# EasyEDA Pro project HIP4082电机驱动.eprj

# Schematic 电机驱动原理图
Create Date: 2023-09-19; Page Name: P1; Project Name: HIP4082电机驱动; Schematic Name: 电机驱动原理图; Update Date: 2023-10-26; Company: 嘉立创EDA; Page Size: A4; Version: V1.0
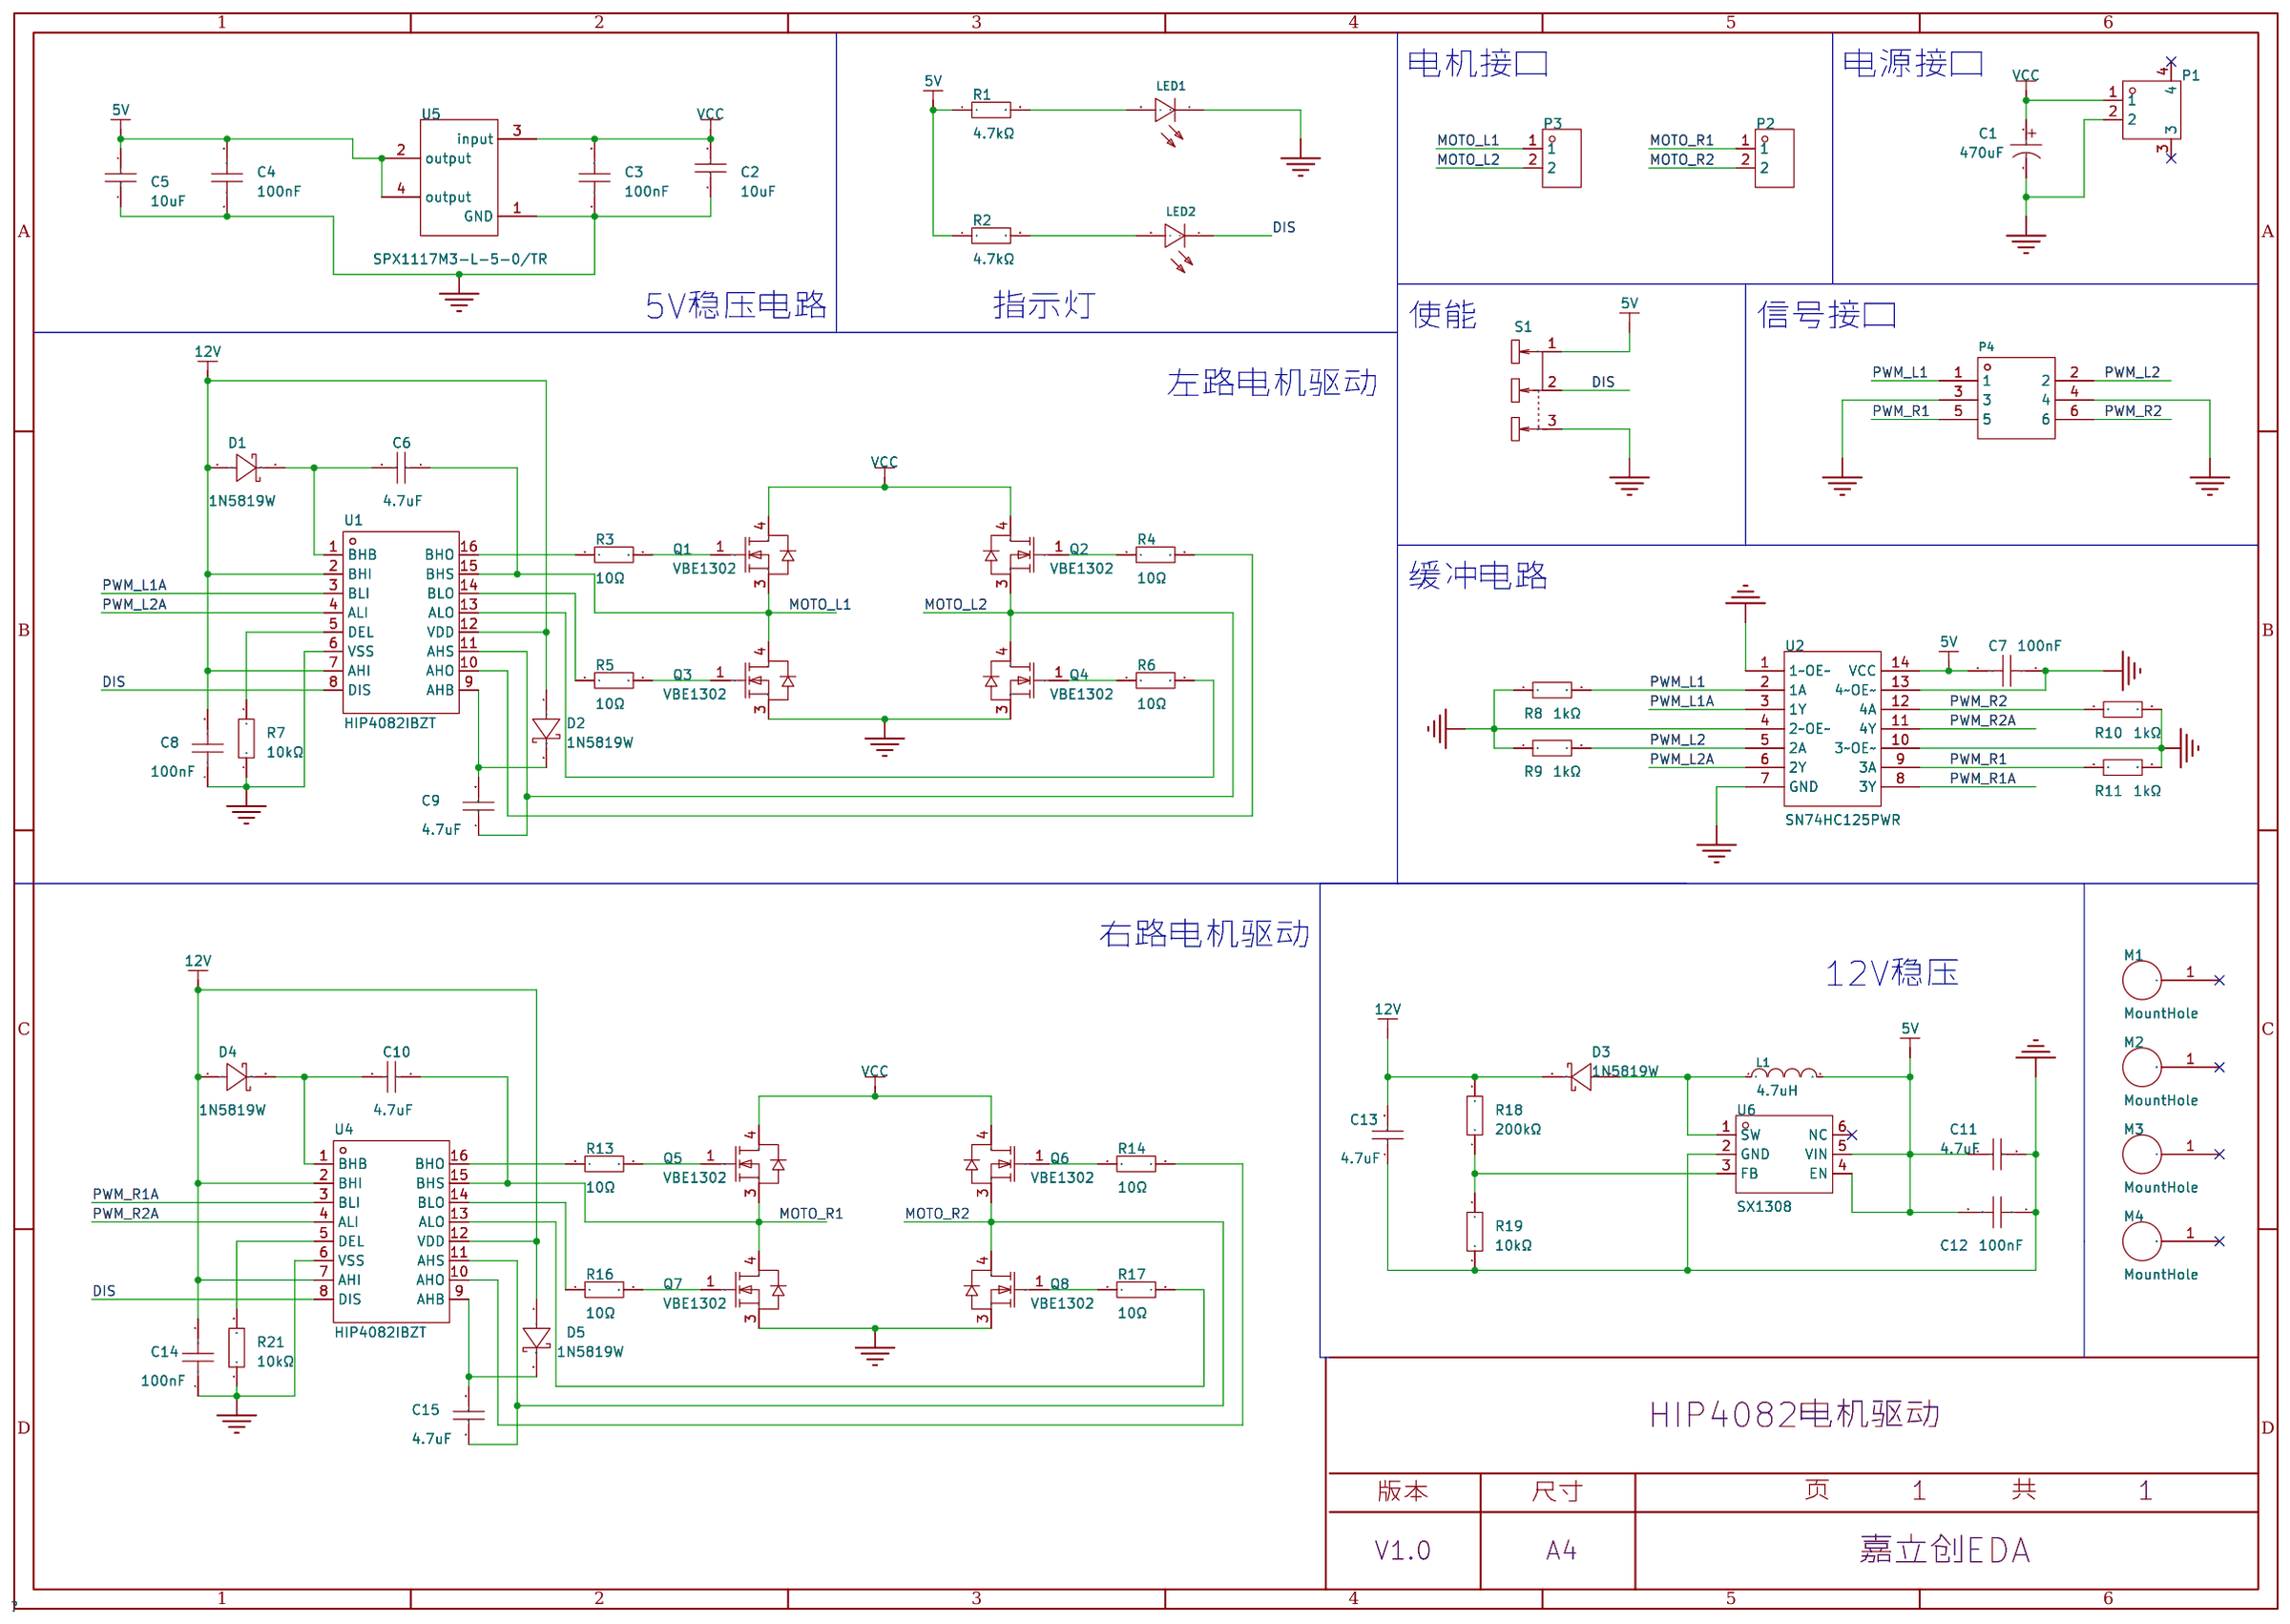
[diagram p0: schematic sheet]

## Parts
C1  470uF  [CAP-TH_BD8.0-P3.50-D0.6-FD]
C2  10uF  [C0805]
C3  100nF  [C0603]
C4  100nF  [C0603]
C5  10uF  [C0805]
C6  4.7uF  [C0603]
C7  100nF  [C0603]
C8  100nF  [C0603]
C9  4.7uF  [C0603]
C10  4.7uF  [C0603]
C11  4.7uF  [C0603]
C12  100nF  [C0603]
C13  4.7uF  [C0603]
C14  100nF  [C0603]
C15  4.7uF  [C0603]
D1  1N5819W  [SOD-123_L2.7-W1.6-LS3.7-R-RD]
D2  1N5819W  [SOD-123_L2.7-W1.6-LS3.7-R-RD]
D3  1N5819W  [SOD-123_L2.7-W1.6-LS3.7-R-RD]
D4  1N5819W  [SOD-123_L2.7-W1.6-LS3.7-R-RD]
D5  1N5819W  [SOD-123_L2.7-W1.6-LS3.7-R-RD]
L1  4.7uH  [IND-SMD_L5.4-W5.2_FXL0530]
LED1  NCD0603R1  [LED0603-RD_RED]
LED2  NCD0603B1  [LED0603-RD]
M1  MountHole  [M3-MountSlot]
M2  MountHole  [M3-MountSlot]
M3  MountHole  [M3-MountSlot]
M4  MountHole  [M3-MountSlot]
P1  XT30PW-M  [CONN-TH_XT30PW-M]
P2  XT30U-M  [CONN-TH_XT30U-M]
P3  XT30U-M  [CONN-TH_XT30U-M]
P4  75869-131LF  [CONN-TH_6P-P2.54_75869-131LF]
Q1  VBE1302  [TO-252-2_L6.6-W6.1-P4.58-LS9.9-TL-1]
Q2  VBE1302  [TO-252-2_L6.6-W6.1-P4.58-LS9.9-TL-1]
Q3  VBE1302  [TO-252-2_L6.6-W6.1-P4.58-LS9.9-TL-1]
Q4  VBE1302  [TO-252-2_L6.6-W6.1-P4.58-LS9.9-TL-1]
Q5  VBE1302  [TO-252-2_L6.6-W6.1-P4.58-LS9.9-TL-1]
Q6  VBE1302  [TO-252-2_L6.6-W6.1-P4.58-LS9.9-TL-1]
Q7  VBE1302  [TO-252-2_L6.6-W6.1-P4.58-LS9.9-TL-1]
Q8  VBE1302  [TO-252-2_L6.6-W6.1-P4.58-LS9.9-TL-1]
R1  4.7kΩ  [R0603]
R2  4.7kΩ  [R0603]
R3  10Ω  [R0603]
R4  10Ω  [R0603]
R5  10Ω  [R0603]
R6  10Ω  [R0603]
R7  10kΩ  [R0603]
R8  1kΩ  [R0603]
R9  1kΩ  [R0603]
R10  1kΩ  [R0603]
R11  1kΩ  [R0603]
R13  10Ω  [R0603]
R14  10Ω  [R0603]
R16  10Ω  [R0603]
R17  10Ω  [R0603]
R18  200kΩ  [R0603]
R19  10kΩ  [R0603]
R21  10kΩ  [R0603]
S1  SS-12D10L3  [SW-TH_SS-12D10L3]
U1  HIP4082IBZT  [SOIC-16_L9.9-W3.9-P1.27-LS6.0-BL]
U2  SN74HC125PWR  [TSSOP-14]
U4  HIP4082IBZT  [SOIC-16_L9.9-W3.9-P1.27-LS6.0-BL]
U5  SPX1117M3-L-5-0/TR  [SOT-223-4_L6.5-W3.5-P2.30-LS7.0-BR]
U6  SX1308  [SOT-23-6_L2.9-W1.6-P0.95-LS2.8-BL]

## Library data of the parts
C1 = KM477M025F12RR0VH2FP0: 容值:470uF;精度:±20%;额定电压:25V;; LCSC Part Name: 470uF ±20% 25V; Supplier Part: C43839; Manufacturer: CX(承兴); Supplier Footprint: 插件,D8xL12mm; JLCPCB Part Class: Extended Part; Datasheet: https://atta.szlcsc.com/upload/public/pdf/source/20211027/06D6BA3719C264B639DC286D935D03EA.pdf; Supplier: LCSC; Tolerance: ±20%; Rated Voltage: 25V; φD: 8mm; L: 12mm; Lead Spacing: 3.5mm; Lifetime @ Temp: 2000hrs@105℃
C2 C5 = CL21A106KAYNNNE_C15850: 容值:10uF;精度:±10%;额定电压:25V;材质(温度系数):X5R;; LCSC Part Name: 10uF ±10% 25V; Supplier Part: C15850; Manufacturer: SAMSUNG(三星); Manufacturer Part: CL21A106KAYNNNE; Supplier Footprint: 0805; JLCPCB Part Class: Basic Part; Datasheet: https://atta.szlcsc.com/upload/public/pdf/source/20160103/1457707679302.pdf; Supplier: LCSC; Tolerance: ±10%; Voltage Rated: 25V; Temperature Coefficient: X5R
C3 C4 C7 C8 C12 C14 = CAP_0603: Supplier Footprint: 0603
C6 C9-C11 C13 C15 = CL10A475KO8NNNC: 容值:4.7uF;精度:±10%;额定电压:16V;材质(温度系数):X5R;; LCSC Part Name: 4.7uF ±10% 16V; Supplier Part: C19666; Manufacturer: SAMSUNG(三星); Supplier Footprint: 0603; JLCPCB Part Class: Basic Part; Datasheet: https://atta.szlcsc.com/upload/public/pdf/source/20160103/1457707703134.pdf; Supplier: LCSC; Tolerance: ±10%; Voltage Rated: 16V; Temperature Coefficient: X5R
D1-D5 = 1N5819W_C963381: 二极管配置:独立式;直流反向耐压(Vr):40V;平均整流电流(Io):350mA;正向压降(Vf):600mV@200mA;反向电流(Ir):5uA@30V;; LCSC Part Name: 40V 350mA 600mV@200mA; Supplier Part: C963381; Manufacturer: JSMSEMI(杰盛微); Supplier Footprint: SOD-123; JLCPCB Part Class: 扩展库; Datasheet: https://atta.szlcsc.com/upload/public/pdf/source/20211201/C266112E93E924DFE0C071C9A8E85281.pdf; Supplier: LCSC; Diode Configuration: 独立式; Reverse Voltage (Vr): 40V; Average Rectified Current (Io): 350mA; Forward Voltage (Vf@If): 600mV@200mA; Reverse Leakage Current (Ir): 5uA@30V
L1 = FXL0530-4R7-M: 电感值:4.7uH;精度:±20%;额定电流:4.5A;饱和电流(Isat):5A;; LCSC Part Name: 4.7uH ±20% 4.5A 50mΩ; Supplier Part: C177246; Manufacturer: cjiang(长江微电); Supplier Footprint: SMD,5.4x5.2x2.8mm; JLCPCB Part Class: Extended Part; Supplier: LCSC; Tolerance: ±20%; Rated Current: 4.5A; Saturation Current (Isat): 5A; DC Resistance (DCR): 50mΩ
LED1 = NCD0603R1_C84263: 发光颜色:红灯;; LCSC Part Name: 红灯 0603红灯   正贴; Supplier Part: C84263; Manufacturer: 国星光电; Supplier Footprint: 0603; JLCPCB Part Class: 扩展库; Datasheet: https://atta.szlcsc.com/upload/public/pdf/source/20200820/C84263_DABC6A75E58F576973B407FDBA283D60.pdf; Supplier: LCSC; Emitted Color: 红灯
LED2 = NCD0603B1: 发光颜色:蓝灯;; LCSC Part Name: 蓝灯; Supplier Part: C84266; Manufacturer: 国星光电; Supplier Footprint: 0603; JLCPCB Part Class: 扩展库; Datasheet: https://atta.szlcsc.com/upload/public/pdf/source/20200820/C84266_6A3CDBEFA72C6CAD68EDA53474ADAE6C.pdf; Supplier: LCSC; Emitted Color: 蓝灯
M1-M4 = MountHole
P1 = XT30PW-M: Socket,DCsupply,XT30,male,PIN:2; LCSC Part Name: AMASS(艾迈斯)航模插头 卧式弯脚 XT30PW-M公头; Supplier Part: C431092; Manufacturer: AMASS(艾迈斯); JLCPCB Part Class: Extended Part; Datasheet: https://atta.szlcsc.com/upload/public/pdf/source/20220222/6A9F22F7850E25B33E1BE430ADF8560B.pdf; Supplier: LCSC
P2 P3 = XT30U-M: 模型插头轻量版锂电池插头; LCSC Part Name: AMASS(艾迈斯)轻量版锂电池插头公头 XT30U-M; Supplier Part: C99101; Manufacturer: AMASS(艾迈斯); JLCPCB Part Class: Extended Part; Datasheet: https://atta.szlcsc.com/upload/public/pdf/source/20170606/1496716542582.pdf; Supplier: LCSC
P4 = 75869-131LF: 参考系列:-;间距:2.54mm;插针结构:2x3P;排数:2;每排PIN数:3;行距:2.54mm;安装方式:-;触头材质:磷青铜;; LCSC Part Name: 2.54mm 2x3P; Supplier Part: C168680; Manufacturer: Amphenol; Supplier Footprint: 插件,P=2.54mm; JLCPCB Part Class: 扩展库; Supplier: LCSC; Pitch: 2.54mm; Pins Structure: 2x3P; Number of Rows: 2; Number of PINs Per Row: 3; Row Spacing: 2.54mm; Contact Material: 磷青铜
Q1-Q8 = VBE1302: 类型:N沟道;漏源电压(Vdss):30V;连续漏极电流(Id):120A;功率(Pd):250W;导通电阻(RDS(on)@Vgs,Id):2.3mΩ@10V,38.8A;阈值电压(Vgs(th)@Id):2.5V@250uA;; LCSC Part Name: N沟道 30V 120A; Supplier Part: C480950; Manufacturer: VBsemi(微碧); Supplier Footprint: TO-252; JLCPCB Part Class: Extended Part; Datasheet: https://atta.szlcsc.com/upload/public/pdf/source/20200107/C480950_B2D90700319A601701C79A4F7CBE2FAC.pdf; Supplier: LCSC; Type: N沟道; Drain Source Voltage (Vdss): 30V; Continuous Drain Current (Id): 120A; Power Dissipation (Pd): 250W; Drain Source On Resistance (RDS(on)@Vgs,Id): 2.3mΩ@10V,38.8A; Gate Threshold Voltage (Vgs(th)@Id): 2.5V@250uA
R1 R2 = 0603WAF4701T5E: 电阻类型:厚膜电阻;阻值:4.7kΩ;精度:±1%;功率:100mW;; LCSC Part Name: 4.7kΩ ±1% 100mW; Supplier Part: C23162; Manufacturer: UNI-ROYAL(厚声); Supplier Footprint: 0603; JLCPCB Part Class: 基础库; Datasheet: https://atta.szlcsc.com/upload/public/pdf/source/20200306/C422600_1E6D84923E4A46A82E41ADD87F860B5C.pdf; Supplier: LCSC; Type: 厚膜电阻; Tolerance: ±1%; Power(Watts): 100mW; Temperature Coefficient: ±100ppm/℃; Overload Voltage (Max): 75V; Operating Temperature Range: -55℃~+155℃
R3-R6 R13 R14 R16 R17 = 0603WAF100JT5E: 电阻类型:厚膜电阻;阻值:10Ω;精度:±1%;功率:100mW;; LCSC Part Name: 10Ω ±1% 100mW; Supplier Part: C22859; Manufacturer: UNI-ROYAL(厚声); Supplier Footprint: 0603; JLCPCB Part Class: 基础库; Datasheet: https://atta.szlcsc.com/upload/public/pdf/source/20200306/C422600_1E6D84923E4A46A82E41ADD87F860B5C.pdf; Supplier: LCSC; Type: 厚膜电阻; Tolerance: ±1%; Power(Watts): 100mW; Temperature Coefficient: ±400ppm/℃; Overload Voltage (Max): 75V; Operating Temperature Range: -55℃~+155℃
R7 R19 R21 = 0603WAF1002T5E: 电阻类型:厚膜电阻;阻值:10kΩ;精度:±1%;功率:100mW;; LCSC Part Name: 厚膜电阻 10kΩ ±1% 100mW; Supplier Part: C25804; Manufacturer: UNI-ROYAL(厚声); Supplier Footprint: 0603; JLCPCB Part Class: Basic Part; Datasheet: https://atta.szlcsc.com/upload/public/pdf/source/20200306/C422600_1E6D84923E4A46A82E41ADD87F860B5C.pdf; Supplier: LCSC; Type: 厚膜电阻; Tolerance: ±1%; Power(Watts): 100mW; Temperature Coefficient: ±100ppm/℃; Overload Voltage (Max): 75V; Operating Temperature Range: -55℃~+155℃
R8-R11 = 0603WAF1001T5E: 电阻类型:厚膜电阻;阻值:1kΩ;精度:±1%;功率:100mW;; LCSC Part Name: 1kΩ ±1% 100mW; Supplier Part: C21190; Manufacturer: UNI-ROYAL(厚声); Supplier Footprint: 0603; JLCPCB Part Class: Basic Part; Datasheet: https://atta.szlcsc.com/upload/public/pdf/source/20200306/C422600_1E6D84923E4A46A82E41ADD87F860B5C.pdf; Supplier: LCSC; Type: 厚膜电阻; Tolerance: ±1%; Power(Watts): 100mW; Temperature Coefficient: ±100ppm/℃; Overload Voltage (Max): 75V; Operating Temperature Range: -55℃~+155℃
R18 = 0603WAF2003T5E: 电阻类型:厚膜电阻;阻值:200kΩ;精度:±1%;功率:100mW;; LCSC Part Name: 200kΩ ±1% 100mW; Supplier Part: C25811; Manufacturer: UNI-ROYAL(厚声); Supplier Footprint: 0603; JLCPCB Part Class: Basic Part; Datasheet: https://atta.szlcsc.com/upload/public/pdf/source/20200306/C422600_1E6D84923E4A46A82E41ADD87F860B5C.pdf; Supplier: LCSC; Type: 厚膜电阻; Tolerance: ±1%; Power(Watts): 100mW; Temperature Coefficient: ±100ppm/℃; Overload Voltage (Max): 75V; Operating Temperature Range: -55℃~+155℃
S1 = SS-12D10L3: 额定电流(DC):3A;额定电压(DC):125V;额定电流(AC):3A;额定电压(AC):125V;电路结构:单刀双掷;安装方式:直插;机械寿命:1万次;开关颜色:黑色;; LCSC Part Name: 柄长3mm 直插双档 滑动开关 大电流; Supplier Part: C319013; Manufacturer: XKB Connectivity(中国星坤); Supplier Footprint: 插件; JLCPCB Part Class: 扩展库; Datasheet: https://atta.szlcsc.com/upload/public/pdf/source/20211009/D6412F37AABE6F9459A6EE7FA4DAEADB.pdf; Supplier: LCSC; Current Rating (DC): 3A; Voltage Rating (DC): 125V; Current Rating (AC): 3A; Voltage Rating (AC): 125V; Circuit: 单刀双掷; Mounting Style: 直插; Mechanical Life: 1万次; Actuator Color: 黑色; Actuator Style: 矩形柱状; Pin Style: PC引脚; Operating Temperature: -40℃~+85℃; Switch Length: 13mm; Switch Width: 6.8mm; Switch Height: 6.4mm
U1 U4 = HIP4082IBZT: 驱动配置:半桥；全桥;负载类型:MOSFET;电源电压:8.5V~15V;; LCSC Part Name: 半桥 全桥 MOSFET; Supplier Part: C50123; Manufacturer: RENESAS(瑞萨)/IDT; Supplier Footprint: SOIC-16; JLCPCB Part Class: 扩展库; Datasheet: https://atta.szlcsc.com/upload/public/pdf/source/20170105/1483610742408.pdf; Supplier: LCSC; Driven Configuration: 半桥；全桥; Load Type: MOSFET; Supply Voltage: 8.5V~15V; Operating Temperature: -55℃~+150℃@(Tj)
U2 = SN74HC125PWR
U5 = SPX1117M3-L-5-0/TR: 输出类型:固定;输出极性:正;最大输入电压:20V;输出电压:5V;输出电流:800mA;电源纹波抑制比(PSRR):75dB@(120Hz);; Supplier Part: C21946; Manufacturer: MaxLinear; Supplier Footprint: SOT-223-4; JLCPCB Part Class: 扩展库; Datasheet: https://atta.szlcsc.com/upload/public/pdf/source/20150912/1457707353858.pdf; Supplier: LCSC; Output Type: 固定; Output Polarity: 正; Number of Outputs: 1; Maximum Input Voltage: 20V; Output Voltage: 5V; Dropout Voltage: 1.3V@(800mA); Output Current: 800mA; Power Supply Rejection Ratio (PSRR): 75dB@(120Hz)
U6 = SX1308: 功能类型:升压型;同步整流:否;输出通道数:1;拓扑结构:升压式;输入电压:2V~24V;输出电压:28V;输出电流(最大值):-;开关频率:1.2MHz;; LCSC Part Name: 升压型 Vin=2V~24V Vout=28V; Supplier Part: C78162; Manufacturer: SX(硕芯科技); Supplier Footprint: SOT-23-6; JLCPCB Part Class: 扩展库; Datasheet: https://atta.szlcsc.com/upload/public/pdf/source/20160920/1474356679185.pdf; Supplier: LCSC; Function: 升压型; Synchronous Rectification: 否; Number of Outputs: 1; Topology: 升压式; Input Voltage: 2V~24V; Output Voltage: 28V; Switching Frequency: 1.2MHz

## Nets
5V: C4.2 C5.2 C7.2 C11.1 C12.2 L1.2 R1.1 R2.1 S1.1 U2.14(VCC) U5.2(output) U5.4(output) U6.4(EN) U6.5(VIN)
12V: C8.2 C13.2 C14.2 D1.1(A) D2.1(A) D3.2(C) D4.1(A) D5.1(A) R18.2 U1.2(BHI) U1.7(AHI) U1.12(VDD) U4.2(BHI) U4.7(AHI) U4.12(VDD)
GND: C1.2 C2.1 C3.1 C4.1 C5.1 C7.1 C8.1 C11.2 C12.1 C13.1 C14.1 LED1.1(K) P1.2 P4.3 P4.4 Q3.3(S) Q4.3(S) Q7.3(S) Q8.3(S) R7.1 R8.1 R9.1 R10.2 R11.2 R19.1 R21.1 S1.3 U1.6(VSS) U2.1(1~OE~) U2.4(2~OE~) U2.7(GND) U2.10(3~OE~) U2.13(4~OE~) U4.6(VSS) U5.1(GND) U6.2(GND)
VCC: C1.1 C2.2 C3.2 P1.1 Q1.4(D) Q2.4(D) Q5.4(D) Q6.4(D) U5.3(input)
DIS: LED2.1(-) S1.2 U1.8(DIS) U4.8(DIS)
MOTO_L1: C6.2 P3.1 Q1.3(S) Q3.4(D) U1.15(BHS)
MOTO_L2: C9.1 P3.2 Q2.3(S) Q4.4(D) U1.11(AHS)
MOTO_R1: C10.2 P2.1 Q5.3(S) Q7.4(D) U4.15(BHS)
MOTO_R2: C15.1 P2.2 Q6.3(S) Q8.4(D) U4.11(AHS)
PWM_L1: P4.1 R8.2 U2.2(1A)
PWM_L1A: U1.3(BLI) U2.3(1Y)
PWM_L2: P4.2 R9.2 U2.5(2A)
PWM_L2A: U1.4(ALI) U2.6(2Y)
PWM_R1: P4.5 R11.1 U2.9(3A)
PWM_R1A: U2.8(3Y) U4.3(BLI)
PWM_R2: P4.6 R10.1 U2.12(4A)
PWM_R2A: U2.11(4Y) U4.4(ALI)
$1N3040: D3.1(A) L1.1 U6.1(SW)
$1N3062: R18.1 R19.2 U6.3(FB)
$1N3258: C6.1 D1.2(C) U1.1(BHB)
$1N3267: R3.1 U1.16(BHO)
$1N3270: Q1.1(G) R3.2
$1N3283: Q2.1(G) R4.1
$1N3296: Q3.1(G) R5.2
$1N3336: R5.1 U1.14(BLO)
$1N3352: Q4.1(G) R6.1
$1N3355: R6.2 U1.13(ALO)
$1N3402: R4.2 U1.10(AHO)
$1N3493: C9.2 D2.2(C) U1.9(AHB)
$1N3539: R7.2 U1.5(DEL)
$1N4214: C10.1 D4.2(C) U4.1(BHB)
$1N4219: R13.1 U4.16(BHO)
$1N4221: Q5.1(G) R13.2
$1N4227: Q6.1(G) R14.1
$1N4229: Q7.1(G) R16.2
$1N4242: R16.1 U4.14(BLO)
$1N4257: Q8.1(G) R17.1
$1N4259: R17.2 U4.13(ALO)
$1N4265: R14.2 U4.10(AHO)
$1N4285: C15.2 D5.2(C) U4.9(AHB)
$1N4295: R21.2 U4.5(DEL)
Net-(LED1-2): LED1.2(A) R1.2
Net-(LED2-2): LED2.2(+) R2.2

Not connected (* = marked no-connect by the designer): M1 1*; M2 1*; M3 1*; M4 1*; P1 3* 4*; U6 6(NC)*

## Notes on the sheet
- 电机接口
- 电源接口
- 5V稳压电路
- 指示灯
- 使能
- 信号接口
- 左路电机驱动
- 缓冲电路
- 右路电机驱动
- 12V稳压

# Board PCB1
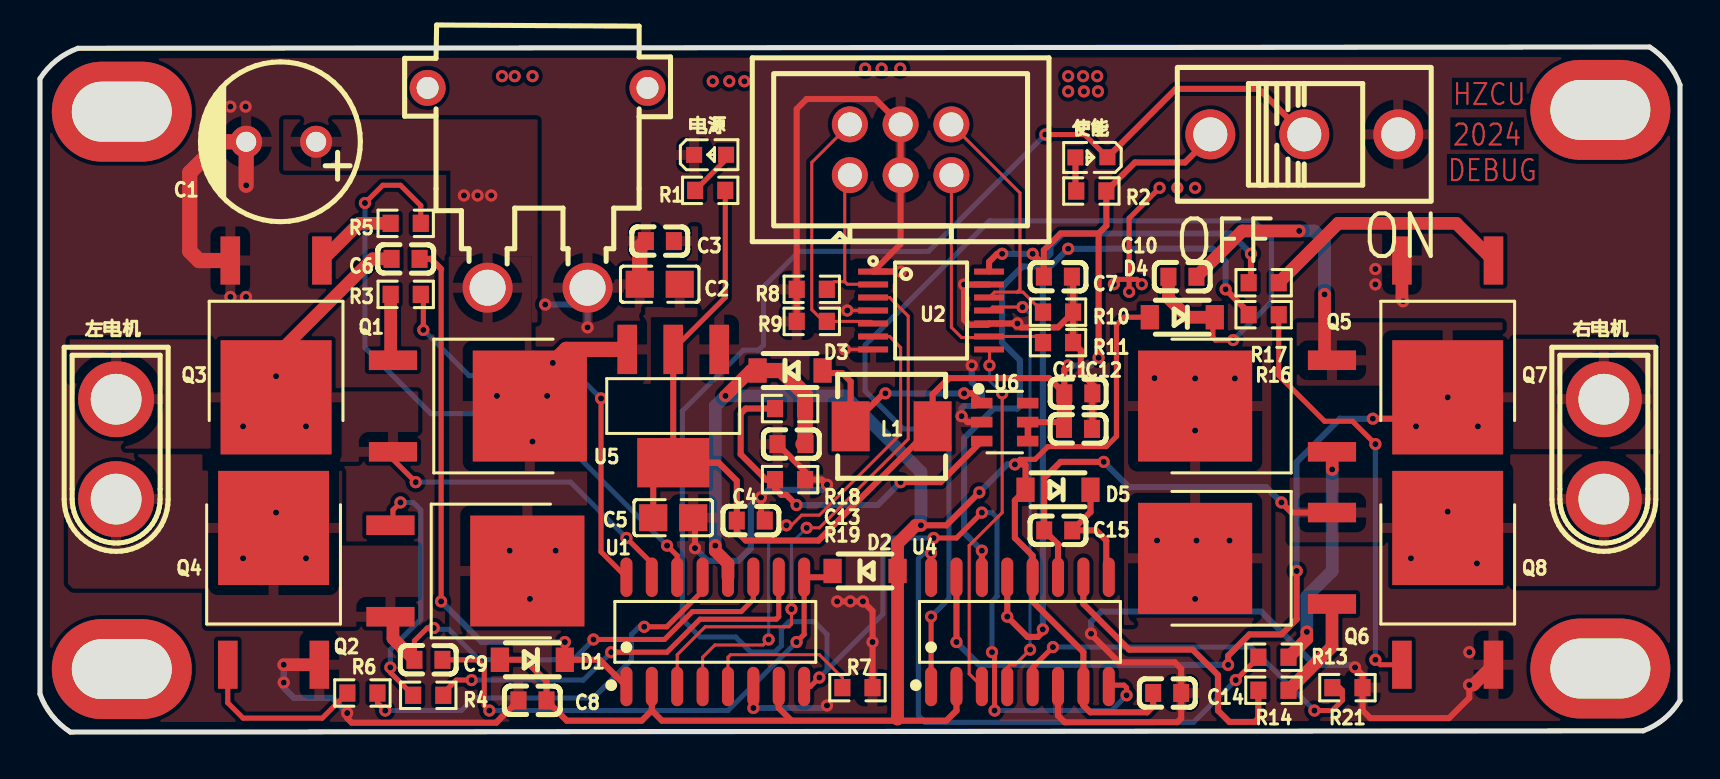
[diagram p1: board, top side]
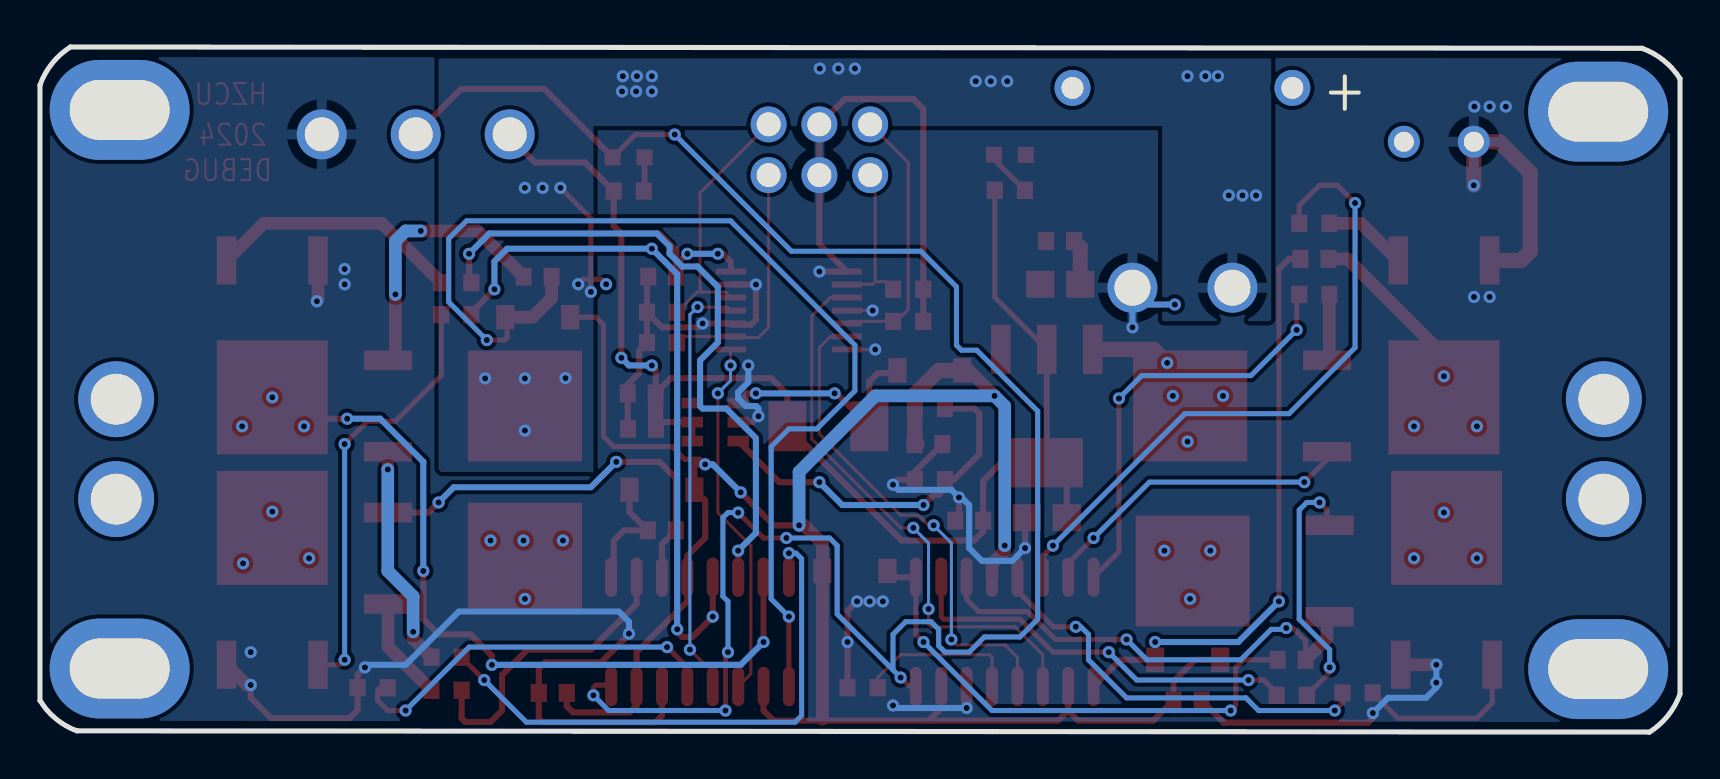
[diagram p2: board, bottom side, seen from below]

Outline 82.04 x 34.29 mm; copper layers: Top Layer, Bottom Layer. Coordinates in mm from the lower left corner of the outline.
Outline path: 0,32.7 arc(0.83,33.62) 1.91,34.23 80.52,34.29 arc(81.44,33.46) 82.04,32.38 82.04,1.59 arc(81.25,0.67) 80.2,0.06 1.52,0 arc(0.6,0.83) 0,1.91 0,32.7
Stack: Top Layer 0.035mm / Dielectric1 1.51mm FR4 er 4.5 / Bottom Layer 0.035mm

## Design rules (mm)
template: JLCPCB Capability(Two Layers Board)
spacing copperThickness1oz (default): track to track 0.102, other pairs 0.152 to 0.3
spacing copperThickness2oz: track to track 0.203, other pairs 0.152 to 0.3
track width copperThickness1oz (default): min 0.127, default 0.254, max 2.54
track width copperThickness2oz: min 0.203, default 0.254, max 2.54
differential pair differentialPair (default): width min 0.127, default 0.254, max 2.54; gap min 0.152, default 0.152
via viaSize (default): diameter min 0.5, default 0.61, max 10; hole min 0.3, default 0.305, max 6.3

## Placement (name value [footprint] x y rotation side)
C1  470uF  [CAP-TH_BD8.0-P3.50-D0.6-FD]  12.06 29.55 180 top
C2  10uF  [C0805]  31 22.42 0 top
C3  100nF  [C0603]  31.01 24.57 0 top
C4  100nF  [C0603]  35.56 10.59 180 top
C5  10uF  [C0805]  31.68 10.73 180 top
C6  4.7uF  [C0603]  18.29 23.69 180 top
C7  100nF  [C0603]  50.92 22.8 180 top
C8  100nF  [C0603]  24.64 1.59 0 top
C9  4.7uF  [C0603]  19.43 3.62 0 top
C10  4.7uF  [C0603]  57.15 22.79 0 top
C11  4.7uF  [C0603]  51.94 16.95 0 top
C12  100nF  [C0603]  51.93 15.18 180 top
C13  4.7uF  [C0603]  37.59 14.41 0 top
C14  100nF  [C0603]  56.39 1.96 180 top
C15  4.7uF  [C0603]  50.93 10.1 0 top
D1  1N5819W  [SOD-123_L2.7-W1.6-LS3.7-R-RD]  24.63 3.62 180 top
D2  1N5819W  [SOD-123_L2.7-W1.6-LS3.7-R-RD]  41.28 8.06 0 top
D3  1N5819W  [SOD-123_L2.7-W1.6-LS3.7-R-RD]  37.52 18.1 0 top
D4  1N5819W  [SOD-123_L2.7-W1.6-LS3.7-R-RD]  57.14 20.76 180 top
D5  1N5819W  [SOD-123_L2.7-W1.6-LS3.7-R-RD]  50.93 12.13 180 top
L1  4.7uH  [IND-SMD_L5.4-W5.2_FXL0530]  42.6 15.3 0 top
M1  MountHole  [M3-MountSlot]  -106.66 2.57 0 top
M2  MountHole  [M3-MountSlot]  -106.66 30.47 0 top
M3  MountHole  [M3-MountSlot]  -32.69 30.56 0 top
M4  MountHole  [M3-MountSlot]  -32.69 2.6 0 top
P1  XT30PW-M  [conn-th_xt30pw-m]  24.89 27.24 180 top
P4  75869-131LF  [CONN-TH_6P-P2.54_75869-131LF]  43.05 29.15 0 top
Q1  VBE1302  [TO-252-2_L6.6-W6.1-P4.58-LS9.9-TL-1]  21.08 16.32 0 top
Q2  VBE1302  [TO-252-2_L6.6-W6.1-P4.58-LS9.9-TL-1]  20.96 8.06 0 top
Q3  VBE1302  [TO-252-2_L6.6-W6.1-P4.58-LS9.9-TL-1]  11.81 20.18 270 top
Q4  VBE1302  [TO-252-2_L6.6-W6.1-P4.58-LS9.9-TL-1]  11.68 6.79 90 top
Q5  VBE1302  [TO-252-2_L6.6-W6.1-P4.58-LS9.9-TL-1]  61.21 16.32 180 top
Q6  VBE1302  [TO-252-2_L6.6-W6.1-P4.58-LS9.9-TL-1]  61.21 8.7 180 top
Q7  VBE1302  [TO-252-2_L6.6-W6.1-P4.58-LS9.9-TL-1]  70.42 20.18 270 top
Q8  VBE1302  [TO-252-2_L6.6-W6.1-P4.58-LS9.9-TL-1]  70.42 6.79 90 top
R1  4.7kΩ  [R0603]  33.53 27.11 180 top
R2  4.7kΩ  [R0603]  52.59 27.08 180 top
R3  10Ω  [R0603]  18.3 21.91 180 top
R4  10Ω  [R0603]  19.42 1.84 0 top
R5  10Ω  [R0603]  18.3 25.46 180 top
R6  10Ω  [R0603]  16.13 1.96 0 top
R7  10kΩ  [R0603]  40.89 2.22 180 top
R8  1kΩ  [R0603]  38.61 22.16 0 top
R9  1kΩ  [R0603]  38.61 20.56 0 top
R10  1kΩ  [R0603]  50.93 21.02 0 top
R11  1kΩ  [R0603]  50.93 19.49 0 top
R13  10Ω  [R0603]  61.7 3.75 0 top
R14  10Ω  [R0603]  61.7 2.1 180 top
R16  10Ω  [R0603]  61.21 22.49 0 top
R17  10Ω  [R0603]  61.21 20.89 180 top
R18  200kΩ  [R0603]  37.52 16.19 0 top
R19  10kΩ  [R0603]  37.52 12.64 180 top
R21  10kΩ  [R0603]  65.41 2.22 180 top
S1  SS-12D10L3  [SW-TH_SS-12D10L3]  63.25 29.92 0 top
U1  HIP4082IBZT  [SOIC-16_L9.9-W3.9-P1.27-LS6.0-BL]  33.78 5.02 0 top
U2  SN74HC125PWR  [TSSOP-14]  44.58 21.1 0 top
U4  HIP4082IBZT  [SOIC-16_L9.9-W3.9-P1.27-LS6.0-BL]  49.02 5.02 0 top
U5  SPX1117M3-L-5-0/TR  [SOT-223-4_L6.5-W3.5-P2.30-LS7.0-BR]  31.68 16.32 90 top
U6  SX1308  [SOT-23-6_L2.9-W1.6-P0.95-LS2.8-BL]  48.26 15.52 270 top
使能  NCD0603B1  [LED0603-RD]  52.6 28.77 180 top
右电机  XT30U-M  [CONN-TH_XT30U-M]  78.23 14.16 270 top
左电机  XT30U-M  [CONN-TH_XT30U-M]  3.81 14.16 270 top
电源  NCD0603R1  [LED0603-RD_RED]  33.52 28.89 0 top

## Footprints (pads in the part's own frame, mm; a bottom-side part is the same pattern mirrored in y, then rotated)
C0603
  rect 0.8x0.9 smd: 1(-0.7,0) 2(0.7,0)
C0805
  rect 1.41x1.35 smd: 1(-1,0) 2(1,0)
CAP-TH_BD8.0-P3.50-D0.6-FD
  round 1.6 hole 1: 1(-1.75,0) 2(1.75,0)
CONN-TH_6P-P2.54_75869-131LF
  round 1.8 hole 1.2: 1(-2.54,-1.27) 2(-2.54,1.27) 3(0,-1.27) 4(0,1.27) 5(2.54,-1.27) 6(2.54,1.27)
conn-th_xt30pw-m
  round 2.5 hole 1.8: 1(2.5,5) 2(-2.5,5)
  round 1.8 hole 1.1: 3(-5.5,-5) 4(5.5,-5)
CONN-TH_XT30U-M
  round 3.8 hole 2.54: 1(-2.5,0) 2(2.5,0)
IND-SMD_L5.4-W5.2_FXL0530
  rect 1.9x2.5 smd: 1(-2.05,0) 2(2.05,0)
LED0603-RD
  rect 0.8x0.8 smd: 1(-0.799,-0.004) 2(0.799,0.004)
LED0603-RD_RED
  rect 0.8x0.8 smd: 1(-0.799,-0.004) 2(0.799,0.004)
M3-MountSlot
  oval 7x5 hole 5x3: 1(110.752,0.579)
R0603
  rect 0.806x0.864 smd: 1(-0.753,0) 2(0.753,0)
SOD-123_L2.7-W1.6-LS3.7-R-RD
  rect 0.909x1.219 smd: 1(1.625,0) 2(-1.625,0)
SOIC-16_L9.9-W3.9-P1.27-LS6.0-BL
  oval 0.602x1.971 smd: 1(-4.445,-2.736) 2(-3.175,-2.736) 3(-1.905,-2.736) 4(-0.635,-2.736) 5(0.635,-2.736) 6(1.905,-2.736) 7(3.175,-2.736) 8(4.445,-2.736) 9(4.445,2.736) 10(3.175,2.736) 11(1.905,2.736) 12(0.635,2.736) 13(-0.635,2.736) 14(-1.905,2.736) 15(-3.175,2.736) 16(-4.445,2.736)
SOT-23-6_L2.9-W1.6-P0.95-LS2.8-BL
  rect 0.532x1.072 smd: 1(-0.95,-1.149) 2(0,-1.149) 3(0.95,-1.149) 4(0.95,1.149) 5(0,1.149) 6(-0.95,1.149)
SOT-223-4_L6.5-W3.5-P2.30-LS7.0-BR
  rect 2.47x0.98 smd: 1(2.835,-2.3) 2(2.835,0) 3(2.835,2.3)
  rect 2.47x3.6 smd: 4(-2.835,0)
SW-TH_SS-12D10L3
  round 2.5 hole 1.7: 1(-4.7,0) 2(0,0) 3(4.7,0)
TO-252-2_L6.6-W6.1-P4.58-LS9.9-TL-1
  rect 2.409x0.979 smd: 1(-3.424,2.29) 3(-3.424,-2.29)
  rect 5.711x5.548 smd: 4(3.424,0)
TSSOP-14
  rect 1.5x0.3 smd: 1(-2.9,1.95) 2(-2.9,1.3) 3(-2.9,0.65) 4(-2.9,0) 5(-2.9,-0.65) 6(-2.9,-1.3) 7(-2.9,-1.95) 8(2.9,-1.95) 9(2.9,-1.3) 10(2.9,-0.65) 11(2.9,0) 12(2.9,0.65) 13(2.9,1.3) 14(2.9,1.95)

## Nets
As in the schematic, except:
GND: C1.2 C2.1 C3.1 C4.1 C5.1 C7.1 C8.1 C11.2 C12.1 C13.1 C14.1 P1.2 P4.3 P4.4 Q3.3 Q4.3 Q7.3 Q8.3 R7.1 R8.1 R9.1 R10.2 R11.2 R19.1 R21.1 S1.3 U1.6 U2.1 U2.4 U2.7 U2.10 U2.13 U4.6 U5.1 U6.2 电源.1
DIS: S1.2 U1.8 U4.8 使能.1
MOTO_L1: C6.2 Q1.3 Q3.4 U1.15 左电机.1
MOTO_L2: C9.1 Q2.3 Q4.4 U1.11 左电机.2
MOTO_R1: C10.2 Q5.3 Q7.4 U4.15 右电机.1
MOTO_R2: C15.1 Q6.3 Q8.4 U4.11 右电机.2
$1N3210: R1.2 电源.2
$1N3213: R2.2 使能.2

Pads without a net: M1 1; M2 1; M3 1; M4 1; P1 3 4; U6 6

## Via types
v1: diameter 0.61, hole 0.305, Top Layer to Bottom Layer, 155 vias

## Routing (per net, layer and track width the routed paths; a pad name or vN(x,y) marks a point on that pad's centre or on a via; arc(x,y) is an arc through that point)
5V: length 76
  Top Layer w0.254: R1.1 34.28,21.76 U5.2
  Top Layer w0.305: v1(51.44,18.35) 51.24,18.16 C11.1 50.48,17.72 45.47,17.72 44.65,16.9 L1.2 38.94,9.59 35.31,9.59 34.86,10.03 34.86,12.57 33.95,13.48 U5.4 ; U2.14 47.48,23.54 47.88,23.94 v1(48.13,23.94) ; U5.4 30.68,12.48 C5.2 ; U5.4 U5.2 ; C12.2 50.89,15.52 U6.5 49.41,14.57 ; v1(49.66,23.94) 50.22,23.38 ; 50.22,23.38 C7.2 ; 50.22,23.38 50.22,24.12 51.05,24.96 52.96,24.96 ; 52.96,24.96 53.35,25.34 53.35,27.08 54.78,28.51 57.28,28.51 58.55,29.78 S1.1 ; 52.96,24.96 v1(52.96,18.73)
  Top Layer w0.762: C11.1 51.24,15.19 C12.2
  Bottom Layer w0.305: v1(49.66,23.94) v1(48.13,23.94) ; v1(52.96,18.73) 52.58,18.35 v1(51.44,18.35)
12V: length 108.8
  Top Layer w0.254: 55.52,20.76 54.23,20.76 53.85,20.38 53.85,14.8 53.34,14.29 50.42,14.29 49.78,13.65 49.02,13.65 v1(48.77,13.4)
  Top Layer w0.305: v1(46.99,12) 45.34,10.35 v1(44.07,10.35) ; v1(48.77,13.4) 49.28,13.4 49.3,13.37 D5.1 48.77,11.59 48.77,9.72 49.66,8.83 U4.12 49.66,6.54 52.2,4 U4.7 52.2,1.33 52.54,0.99 55.38,0.99 55.69,1.3 C14.2 ; 30.61,1.08 30.1,0.57 26.35,0.57 C8.2 25.34,2.54 24.26,3.62 23,3.62 ; 30.61,1.08 U1.2 ; 30.61,1.08 31.12,0.57 37.59,0.57 ; 36.96,2.28 36.96,1.21 37.59,0.57 ; 37.59,0.57 45.34,0.57 45.85,1.08 45.85,2.28
  Top Layer w0.635: D3.2 35.56,18.1 v1(34.29,16.83) ; 42.88,0.66 42.9,0.66 D2.1 42.9,9.44 43.81,10.35 v1(44.07,10.35) ; U1.12 34.42,8.44 33.78,9.07 v1(33.78,9.33)
  Top Layer w0.762: 38.17,14.41 38.28,14.52 38.28,16.9 37.08,18.1 D3.2
  Bottom Layer w0.305: v1(48.77,13.4) 48.39,13.4 v1(46.99,12)
  Bottom Layer w0.635: v1(44.07,10.35) 44.07,13.02 40.26,16.83 v1(34.29,16.83) 33.78,16.32 v1(33.78,9.33)
GND: length 154.7
  Top Layer w0.152: U2.7 v1(40.26,19.15) ; U2.4 v1(40.39,21.1)
  Top Layer w0.305: 51.68,21.01 50.93,20.26 49.09,20.26 v1(48.9,20.45) U2.10 47.41,20.38 46.48,20.38 46.23,20.64 v1(46.23,22.4) U2.13 ; 51.68,21.01 R10.2 51.68,22.74 C7.1 ; 51.68,21.01 R11.2 52.07,19.1 52.07,17.97 52.71,17.34 52.71,17.02 C11.2 52.64,15.19 C12.1 ; U4.6 50.93,0.83 51.26,0.49 56.9,0.5 57.09,0.69 C14.1 57.09,3.17 56.77,3.49 53.97,3.49 52.58,4.89 ; v1(39.88,6.54) v1(40.54,6.54) v1(41.17,6.54) 41.65,6.06 v1(41.65,4.51) R7.1 ; 36.26,10.59 36.07,10.78 v1(36.07,11.75) ; C5.1 32.77,10.64 v1(32.77,9.21) ; v1(15.37,0.95) 15.37,0.7 15.6,0.47 22.82,0.47 C8.1 ; C13.1 38.28,13.03 38.28,12.64 39.12,12.64 v1(39.37,12.38) ; v1(35.69,1.21) U1.6 ; R9.1 R8.1 37.85,31.19 38.35,31.69 41.78,31.69 P4.4 P4.3 43.05,24.43 U2.1 v1(43.05,23.05) ; v1(65.79,3.24) 66.16,2.87 R21.1 66.16,1.09 66.55,0.7 70.49,0.7 71.5,1.71 v1(71.5,2.36) ; v1(46.1,15.81) 46.4,15.52 U6.2
  Top Layer w0.635: Q4.3 v1(12.19,3.37) ; v1(71.5,2.36) 71.7,2.36 Q8.3 ; Q7.3 68.13,21.65
  Top Layer w0.762: C3.1 30,24.27 C2.1 ; v1(10.31,27.37) C1.2 9.04,29.55 7.49,28 7.49,24.07 7.96,23.6 Q3.3
  Bottom Layer w0.305: v1(15.37,0.95) 14.61,1.71 12.7,1.71 12.19,2.22 v1(12.19,2.48) v1(12.19,3.37) ; v1(46.61,18.35) 46.61,17.51 47.12,17.01 47.12,16.7 46.74,16.32 46.23,16.32 46.1,16.19 v1(46.1,15.81) ; v1(65.79,3.24) 65.66,3.37 63.75,3.37 61.09,6.03 53.09,6.03 52.58,5.52 v1(52.58,4.93) ; v1(25.27,21.4) 26.55,21.4 P1.2 v1(27.39,20.26) ; v1(35.69,1.21) 39.24,1.21 v1(39.37,1.33) ; v1(32.77,9.21) 33.4,8.57 34.93,8.57 35.56,9.21 35.56,11.37 35.94,11.75 v1(36.07,11.75) 36.45,12.13 39.12,12.13 v1(39.37,12.38)
  vias: v1(8.72,31.31) v1(9.53,31.31) v1(9.53,21.78) v1(10.29,31.31) v1(10.31,21.78) v1(66.8,23.18) v1(66.8,22.41) v1(68.19,21.56) v1(71.5,4)
VCC: length 11.4
  Top Layer w0.254: v1(55.12,22.42) 54.87,22.66 54.48,22.66 ; v1(53.72,22.42) 53.97,22.66 54.48,22.66 ; 54.48,22.66 54.48,25.72 v1(56.01,27.24) ; 54.48,22.66 v1(54.48,22.03)
  Top Layer w0.762: v1(25.65,18.48) 26.33,19.15 U5.3
  vias: v1(21.21,26.86) v1(21.89,26.86) v1(22.57,26.86) v1(22.86,16.83) v1(23.11,32.83) v1(23.5,9.08) v1(23.75,32.83) v1(24.51,6.67) v1(24.64,32.83) v1(24.64,14.54) v1(25.37,16.83) v1(25.79,9.08) v1(33.66,32.58) v1(34.48,32.58) v1(35.23,32.58) v1(41.28,33.21) v1(42.1,33.21) v1(43.03,33.21) v1(51.44,32.83) v1(51.44,32.07) v1(52.18,32.83) v1(52.22,32.07) v1(52.88,32.83) v1(52.93,32.07) v1(55.75,17.72) v1(55.88,9.59) v1(56.9,27.24) v1(57.78,27.24) v1(57.78,17.7) v1(57.78,15.09) v1(57.78,6.67) v1(57.85,9.59) v1(59.5,9.59) v1(59.77,17.7)
DIS: length 96.3
  Top Layer w0.254: 53.47,2.28 53.54,2.35 54.23,2.35 54.36,2.22 v1(54.36,1.84) ; U1.8 38.54,2.28 v1(38.99,2.73) ; v1(47.75,1.08) 47.75,3.87 v1(47.62,4) ; 使能.1 52.26,29.91 v1(50.29,29.91) ; v1(47.12,10.99) 45.85,9.72 v1(44.7,9.72)
  Top Layer w0.305: 使能.1 56.82,32.19 60.97,32.19 S1.2
  Bottom Layer w0.254: v1(44.7,9.72) 42.54,9.72 42.16,9.33 42.16,5.91 39.37,3.11 ; v1(47.75,1.08) 53.59,1.08 v1(54.36,1.84) ; v1(47.62,4) 47.62,6.54 47.88,6.79 47.88,10.73 47.62,10.99 v1(47.12,10.99) ; 39.37,3.11 v1(38.99,2.73) ; 39.37,3.11 39.37,4.89 38.74,5.52 37.47,5.52 37.08,5.14 37.08,4.32 36.77,4 35.56,4 34.8,4.76 33.02,4.76 32.13,5.65 32.13,16.07 35.18,19.11 35.94,19.11 36.19,19.37 36.19,22.29 37.97,24.07 44.45,24.07 v1(50.29,29.91)
MOTO_L1: length 26.1
  Top Layer w0.254: 17.66,14.03 17.66,13.65 v1(18.8,12.51) ; v1(29.34,9.72) 30.61,8.45 U1.15
  Top Layer w0.635: Q3.4 v1(11.81,17.81) 11.81,18.86 16.64,23.69 C6.2
  Bottom Layer w0.254: v1(18.8,12.51) 26.54,12.51 v1(29.34,9.72)
  vias: v1(10.16,15.3) v1(13.31,15.3)
MOTO_L2: length 23.8
  Top Layer w0.254: U1.11 35.69,6.64 35.08,6.03 32.64,6.03 31.24,4.64 v1(27.69,4.64) ; v1(19.7,5.21) 19.37,5.21 18.73,4.57 C9.1
  Top Layer w0.635: 17.66,5.77 17.66,4.69 C9.1
  Bottom Layer w0.254: v1(27.69,4.64) 26.67,3.62 21.97,3.62 20.45,5.14 19.69,5.14
  vias: v1(10.16,8.7) v1(11.81,10.99) v1(13.31,8.7)
MOTO_R1: length 52.4
  Top Layer w0.305: v1(66.68,15.68) 69.35,15.68 v1(70.42,16.76) ; v1(59.44,3.37) 59.44,3.82 60.5,4.89 62.1,4.89 62.87,5.65 v1(62.87,8.06) ; 45.85,7.75 v1(45.85,4.51)
  Top Layer w0.635: C10.2 60.14,25.08 v1(62.99,25.08) ; v1(64.26,21.91) 64.26,18.98 Q5.3
  Bottom Layer w0.305: v1(66.68,15.68) 65.02,15.68 62.87,13.53 v1(62.87,8.06) ; v1(59.44,3.37) 46.99,3.37 v1(45.85,4.51)
  Bottom Layer w0.635: v1(64.26,21.91) 64.26,24.57 63.75,25.08 v1(62.99,25.08)
  vias: v1(68.83,15.3) v1(71.93,15.3)
MOTO_R2: length 21
  Top Layer w0.305: v1(53.21,13.53) 51.05,13.53 50.23,12.71 C15.1 50.93,9.4 U4.11 ; v1(62.1,11.49) 62.61,10.99 Q6.3
  Bottom Layer w0.305: v1(62.1,11.49) 61.34,12.26 54.48,12.26 v1(53.21,13.53)
  vias: v1(68.58,8.7) v1(70.42,11.03) v1(71.88,8.45)
PWM_L1: length 8
  Top Layer w0.152: U2.2 41.66,22.42 40.39,22.42 40.26,22.54 ; R8.2 39.74,22.54 40.26,22.54 ; 40.26,22.54 40.26,27.62 P4.1
PWM_L1A: length 28.3
  Top Layer w0.152: v1(37.59,6.16) 37.59,5.4 37.47,5.27 33.27,5.27 31.88,3.87 U1.3 ; U2.3 42.5,21.75 43.43,20.82 43.43,14.67 38.99,10.22 v1(38.35,10.22)
  Bottom Layer w0.152: v1(38.35,10.22) 37.59,9.46 v1(37.59,6.16)
PWM_L2: length 13.4
  Top Layer w0.152: P4.2 38.61,28.51 38.61,21.15 39.2,20.56 R9.2 41.57,20.56 U2.5
PWM_L2A: length 24.5
  Top Layer w0.152: U1.4 33.15,3.75 33.76,4.36 36.18,4.36 v1(36.45,4.64) ; v1(37.34,10.35) 37.59,10.35 38.1,10.86 38.99,10.86 43.05,14.92 43.05,19.25 42.5,19.8 U2.6
  Bottom Layer w0.152: 36.45,4.89 36.45,9.46 v1(37.34,10.35)
PWM_R1: length 12.6
  Top Layer w0.152: P4.5 45.59,20.26 46.1,19.75 47.42,19.75 U2.9 49.87,19.8 R11.1
PWM_R1A: length 18.1
  Top Layer w0.152: v1(48.13,16.95) 48.13,10.99 46.48,9.33 46.48,2.92 U4.3 ; U2.8 47.5,19.13 v1(47.5,18.35)
  Bottom Layer w0.152: v1(47.5,18.35) 47.5,17.59 v1(48.13,16.95)
PWM_R2: length 13.1
  Top Layer w0.152: R10.1 49.17,22.02 48.88,22.02 ; U2.12 47.75,22.02 48.88,22.02 ; 48.88,22.02 49.02,22.16 49.02,26.99 P4.6
PWM_R2A: length 21.5
  Top Layer w0.152: v1(49.53,4.13) 48.77,3.37 48.51,3.37 48.39,3.24 U4.4 ; v1(49.15,21.27) 47.65,21.27 U2.11
  Bottom Layer w0.152: v1(49.53,4.13) 49.53,20.89 v1(49.15,21.27)
$1N3040: length 11.3
  Top Layer w0.305: v1(42.29,16.95) 42.21,16.95 L1.1 40.55,17.55 40.13,17.97 39.28,17.97 D3.1 ; U6.1 46.62,16.95 v1(46.23,16.95)
  Bottom Layer w0.305: v1(46.23,16.95) v1(42.29,16.95)
$1N3062: length 18.6
  Top Layer w0.305: 47.11,14.57 45.06,12.51 v1(43.05,12.51) ; R18.1 35.31,16.19 35.05,15.94 35.05,13.91 36.32,12.64 R19.2 36.77,12.19 37.08,11.87 37.34,11.87 v1(37.85,11.37)
  Bottom Layer w0.305: v1(37.85,11.37) 41.91,11.37 v1(43.05,12.51)
$1N3210: length 2.4
  Top Layer w0.254: R1.2 34.32,28.66 电源.2
$1N3213: length 1.7
  Top Layer w0.305: 使能.2 51.8,27.12 R2.2
$1N3258: length 29.5
  Top Layer w0.254: v1(20.07,6.54) 20.07,23.18
  Top Layer w0.305: 20.07,23.18 19.56,23.69 C6.1 ; 29.34,2.28 28,3.62 D1.2 v1(26.26,4.51)
  Bottom Layer w0.305: v1(26.26,4.51) 22.1,4.51 v1(20.07,6.54)
$1N3267: length 21.6
  Top Layer w0.254: 29.34,7.75 28.07,9.02 v1(28.07,16.7) ; v1(19.18,20.13) 19.18,21.78 R3.1
  Bottom Layer w0.254: v1(19.18,20.13) 21.46,17.84 26.92,17.84 v1(28.07,16.7)
$1N3270: length 3.3
  Top Layer w0.635: Q1.1 17.54,18.73 R3.2
$1N3283: length 12.8
  Top Layer w0.254: v1(18.03,11.49) 17.66,11.12 17.66,10.35 ; R4.1 17.53,2.99 v1(17.53,3.24)
  Bottom Layer w0.254: v1(17.53,3.24) 17.53,4.13 19.05,5.65 19.05,11.11 18.67,11.49 v1(18.03,11.49)
$1N3296: length 4.2
  Top Layer w0.635: R5.2 15.96,25.46 14.1,23.6
$1N3336: length 32.7
  Top Layer w0.254: R5.1 19.05,26.35 18.03,27.37 17.14,27.37 v1(16.26,26.48) ; U1.14 31.88,8.83 v1(31.37,9.33)
  Bottom Layer w0.254: v1(16.26,26.48) 16.26,19.24 19.56,15.94 24.76,15.94 v1(31.37,9.33)
$1N3352: length 8.7
  Top Layer w0.254: R6.1 14.12,0.7 10.16,0.7 9.39,1.46 Q4.1
$1N3355: length 20.8
  Top Layer w0.254: v1(17.27,1.08) 16.88,1.47 R6.2 ; v1(30.23,5.27) 31.35,5.27 33.15,7.07 U1.13
  Bottom Layer w0.254: v1(17.27,1.08) 21.08,1.08 21.72,1.71 27.69,1.71 29.59,3.62 29.59,4.89 29.97,5.27 v1(30.23,5.27)
$1N3402: length 20.4
  Top Layer w0.254: v1(28.57,4) 31.37,4 33.02,5.65 36.83,5.65 36.96,5.78 36.96,7.75 ; R4.2 20.18,1.95 20.83,2.6 v1(21.59,2.6)
  Bottom Layer w0.254: v1(21.59,2.6) 27.18,2.6 v1(28.57,4)
$1N3493: length 26.3
  Top Layer w0.254: v1(22.48,1.08) 22.22,1.33 22.22,3.24 21.85,3.62 C9.2 ; v1(37.85,4.51) 38.23,4.89 U1.9
  Top Layer w0.305: U1.9 39.34,7.75 D2.2
  Bottom Layer w0.254: v1(22.48,1.08) 34.42,1.08 v1(37.85,4.51)
$1N3539: length 8.2
  Top Layer w0.152: R7.2 40.14,2.72 38.99,3.87 34.54,3.87 34.42,3.75 U1.5
$1N4214: length 55.1
  Top Layer w0.254: v1(59.69,19.62) 58.8,19.62 58.67,19.75 58.67,20.67 D4.2 ; U4.1 v1(44.58,5.78)
  Top Layer w0.635: C10.1 56.45,21.72 57.4,20.76 D4.2
  Bottom Layer w0.254: v1(59.69,19.62) 61.59,21.53 61.59,24.7 60.71,25.59 47.5,25.59 41.28,19.37 41.28,17.08 43.18,15.18 44.58,15.18 45.47,14.29 45.47,6.67 v1(44.58,5.78)
$1N4219: length 28.3
  Top Layer w0.254: R13.1 60.95,3.74 v1(59.82,2.6) ; v1(44.58,8.95) U4.16
  Bottom Layer w0.254: v1(44.58,8.95) 44.22,8.95 43.94,8.68 43.94,0.83 44.27,0.49 57.71,0.49 v1(59.82,2.6)
$1N4221: length 11.2
  Top Layer w0.635: R13.2 63.37,4.66 v1(63.37,5.02) ; 64.63,14.03 64.64,14.02 v1(64.64,13.14)
  Bottom Layer w0.635: v1(64.64,13.14) 64.64,8.06 63.37,6.79 v1(63.37,5.02)
$1N4227: length 5.2
  Top Layer w0.635: Q6.1 64.63,4.27 R14.1
$1N4229: length 12.7
  Top Layer w0.635: R16.2 64.94,25.46 70.85,25.46 Q7.1
$1N4242: length 32.8
  Top Layer w0.305: v1(60.58,23.94) 60.58,22.61 R16.1 ; v1(47.12,9.08) U4.14
  Bottom Layer w0.305: v1(60.58,23.94) 59.56,24.96 51.18,24.96 50.55,24.32 50.55,23.94 49.91,23.3 49.15,23.3 48.13,22.29 48.13,19.49 49.02,18.61 49.02,16.32 48.9,16.19 47.71,16.19 46.23,14.71 46.23,9.97 v1(47.12,9.08)
$1N4257: length 21.5
  Top Layer w0.254: v1(66.8,3.62) 67.05,3.37 Q8.1 ; R17.1 61.97,17.85 64.26,15.56 65.66,15.56 v1(66.8,14.41)
  Bottom Layer w0.254: v1(66.8,14.41) v1(66.8,3.62)
$1N4259: length 35.3
  Top Layer w0.305: R17.2 60.46,21.01 v1(59.31,22.16) ; v1(50.16,5.14) 50.16,5.02 49.91,4.76 49.4,4.76 v1(48.39,5.78) U4.13
  Bottom Layer w0.305: v1(50.16,5.14) 50.16,22.92 v1(51.44,24.19) 58.67,24.19 59.31,23.56 v1(59.31,22.16)
$1N4265: length 15.1
  Top Layer w0.305: U4.10 52.2,6.41 54.48,4.13 57.66,4.13 58.93,2.86 58.93,1.08 59.5,0.51 ; 59.5,0.51 60.77,0.51 60.95,0.69 R14.2
$1N4285: length 6.2
  Top Layer w0.305: 53.47,7.75 53.34,7.88 53.34,9.59 52.83,10.1 51.63,10.1 52.55,11.01 D5.2
$1N4295: length 19.5
  Top Layer w0.254: v1(50.67,4.25) 49.66,3.24 U4.5 ; v1(63.75,1.08) 64.64,1.08 65.15,1.59 65.15,2.1 65.02,2.22 R21.2
  Bottom Layer w0.254: v1(50.67,4.25) 60.58,4.25 v1(63.75,1.08)

## Copper pours and planes (outline as drawn; the poured copper is in the pictures)
GND on Top Layer: -0.89,36.64 85.72,36.64 85.72,-4.13 -1.02,-4.13 -1.02,36.51
GND on Bottom Layer: -0.76,36.64 85.72,36.64 85.85,36.77 85.85,-4.25 -0.89,-4.25 -0.89,36.51
VCC on Top Layer: 12.17,28.1 12.17,30.67 24.89,30.67 24.89,20.5 20.53,20.5 20.53,28.1
VCC on Top Layer: 61.59,19.11 61.59,5.35 54.23,5.35 54.23,19.11
VCC on Top Layer: 20.45,23.81 24.59,23.81 24.59,19.11 27.37,19.11 27.37,4.89 20.47,4.89 20.47,19.11 20.45,19.14
VCC on Top Layer: 31.4,23.32 32.88,23.32 32.89,23.3 32.89,20.76 30.56,20.76 30.56,17.42 28.34,17.44 28.34,20.88 30.28,20.88 30.28,21.27 31.39,21.27 31.4,21.28
VCC on Top Layer: 31.29,25.28 31.29,21.56 32.92,21.56 32.92,25.32 31.33,25.32
VCC on Bottom Layer: 20.45,20.64 20.45,33.72 62.1,33.72 62.1,13.14 61.98,13.02 54.48,13.02 54.36,12.89 54.36,30.33 25.91,30.33 25.91,20.56 20.52,20.56
MOTO_L1 on Top Layer: 18.92,13.53 9.02,13.53 9.02,17.05 18.9,17.05 18.92,17.08
MOTO_L1 on Top Layer: 1.48,14.19 8.76,14.19 8.76,13.88 15.09,13.88 15.11,13.91 15.11,19.66 1.48,19.66
MOTO_L2 on Top Layer: 1.4,13.91 8.13,13.91 8.13,13.09 15.11,13.09 15.11,7.18 1.65,7.18 1.4,7.43
MOTO_L2 on Top Layer: 18.92,5.27 8.3,5.27 8.3,9.33 18.92,9.33
MOTO_R1 on Top Layer: 67.56,14.16 80.83,14.16 80.83,19.69 67.58,19.69 67.56,19.67
MOTO_R1 on Top Layer: 62.87,17.34 67.69,17.34 67.69,13.92 73.17,13.92 73.17,20.49 73.15,20.51 62.87,20.51 62.87,20.51
MOTO_R2 on Top Layer: 67.07,7.3 80.84,7.3 80.84,13.84 80.9,13.91 73.54,13.91 73.54,13.09 67.06,13.09 67.06,7.32
MOTO_R2 on Top Layer: 62.59,9.5 71.03,9.5 71.12,9.59 71.12,12.74 62.51,12.74 62.51,9.58

Small or netless copper shapes (teardrops, artwork), in the pictures only: 1 on Top Layer

## Text on the board
Bottom Silkscreen Layer: +
Top Layer: DEBUG | HZCU | 2024
Top Silkscreen Layer: OFF | ON
